# EAGLE schematic Frontboard (EAGLE 9.0.1)
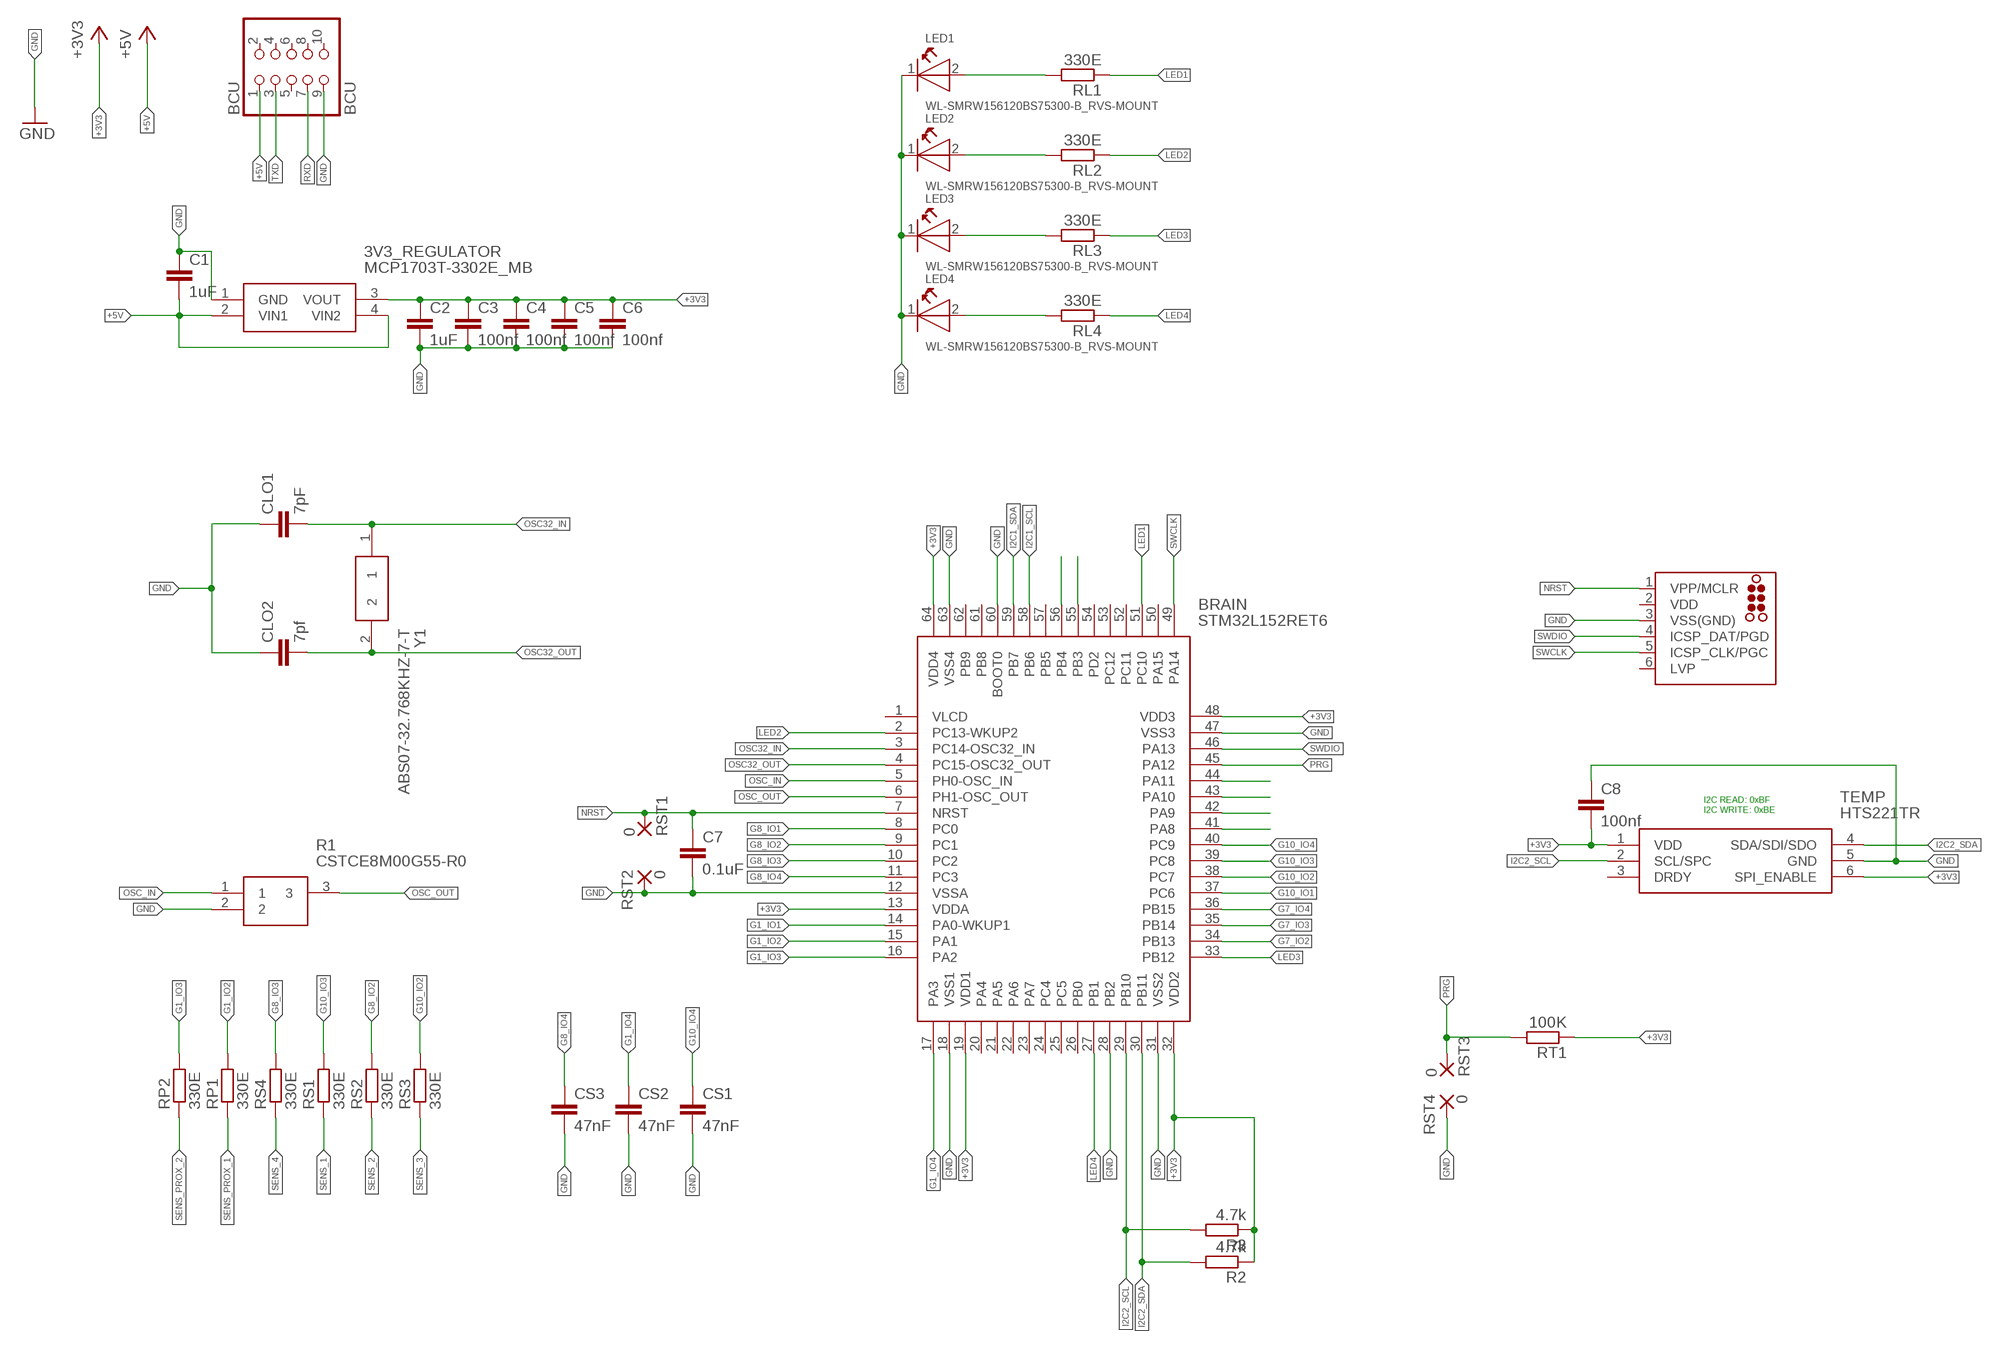
[diagram p0: schematic, sheet 1]

## Parts
3V3_REGULATOR  MCP1703T-3302E_MB  [SOT-89(MB)]
BCU  BCU  PINHD-2X5_2.54-SMD  [2X05SMD]
BRAIN  STM32L152RET6  [QFP50P1200X1200X160-64N]
C1  1uF  C-EUC0603  [C0603]
C2  1uF  C-EUC0603  [C0603]
C3  100nf  C-EUC0603  [C0603]
C4  100nf  C-EUC0603  [C0603]
C5  100nf  C-EUC0603  [C0603]
C6  100nf  C-EUC0603  [C0603]
C7  0.1uF  C-EUC0603  [C0603]
C8  100nf  C-EUC0603  [C0603]
CLO1  7pF  C-EUC0603  [C0603]
CLO2  7pf  C-EUC0603  [C0603]
CS1  47nF  C-EUC0603  [C0603]
CS2  47nF  C-EUC0603  [C0603]
CS3  47nF  C-EUC0603  [C0603]
LED1  WL-SMRW156120BS75300-B_RVS-MOUNT  [WL-SMRW-1206-CYLDR-REVERSE-MOUNT]
LED2  WL-SMRW156120BS75300-B_RVS-MOUNT  [WL-SMRW-1206-CYLDR-REVERSE-MOUNT]
LED3  WL-SMRW156120BS75300-B_RVS-MOUNT  [WL-SMRW-1206-CYLDR-REVERSE-MOUNT]
LED4  WL-SMRW156120BS75300-B_RVS-MOUNT  [WL-SMRW-1206-CYLDR-REVERSE-MOUNT]
R1  CSTCE8M00G55-R0  [CSTCE12M0G55-R0]
R2  4.7k  R-EU_R0603  [R0603]
R3  4.7k  R-EU_R0603  [R0603]
RL1  330E  R-EU_R0603  [R0603]
RL2  330E  R-EU_R0603  [R0603]
RL3  330E  R-EU_R0603  [R0603]
RL4  330E  R-EU_R0603  [R0603]
RP1  330E  R-EU_R0603  [R0603]
RP2  330E  R-EU_R0603  [R0603]
RS1  330E  R-EU_R0603  [R0603]
RS2  330E  R-EU_R0603  [R0603]
RS3  330E  R-EU_R0603  [R0603]
RS4  330E  R-EU_R0603  [R0603]
RST1  0  SMD5  [SMD2,54-5,08]
RST2  0  SMD5  [SMD2,54-5,08]
RST3  0  SMD5  [SMD2,54-5,08]
RST4  0  SMD5  [SMD2,54-5,08]
RT1  100K  R-EU_R0603  [R0603]
SWD  SWD  TC2030-MCP-NL  [TC2030-MCP-NL]
TEMP  HTS221TR  [HLGA-6L]
Y1  ABS07-32.768KHZ-7-T  [ABS-07]

## Nets
+3V3: 3V3_REGULATOR.3(VOUT) BRAIN.13(VDDA) BRAIN.19(VDD1) BRAIN.32(VDD2) BRAIN.48(VDD3) BRAIN.64(VDD4) C2.1 C3.1 C4.1 C5.1 C6.1 C8.2 R2.1 R3.1 RT1.1 TEMP.1(VDD) TEMP.6(SPI_ENABLE)
+5V: 3V3_REGULATOR.2(VIN1) 3V3_REGULATOR.4(VIN2) BCU.1 C1.2
G1_IO1: BRAIN.14(PA0-WKUP1)
G1_IO2: BRAIN.15(PA1) RP1.2
G1_IO3: BRAIN.16(PA2) RP2.2
G1_IO4: BRAIN.17(PA3) CS2.1
G7_IO2: BRAIN.34(PB13)
G7_IO3: BRAIN.35(PB14)
G7_IO4: BRAIN.36(PB15)
G8_IO1: BRAIN.8(PC0)
G8_IO2: BRAIN.9(PC1) RS2.2
G8_IO3: BRAIN.10(PC2) RS4.2
G8_IO4: BRAIN.11(PC3) CS3.1
G10_IO1: BRAIN.37(PC6)
G10_IO2: BRAIN.38(PC7) RS3.2
G10_IO3: BRAIN.39(PC8) RS1.2
G10_IO4: BRAIN.40(PC9) CS1.1
GND: 3V3_REGULATOR.1(GND) BCU.9 BRAIN.12(VSSA) BRAIN.18(VSS1) BRAIN.28(PB2) BRAIN.31(VSS2) BRAIN.47(VSS3) BRAIN.60(BOOT0) BRAIN.63(VSS4) C1.1 C2.2 C3.2 C4.2 C5.2 C6.2 C7.2 C8.1 CLO1.1 CLO2.1 CS1.2 CS2.2 CS3.2 LED1.1(K) LED2.1(K) LED3.1(K) LED4.1(K) R1.2 RST2.1(P) RST4.1(P) SWD.3(VSS(GND)) TEMP.5(GND)
I2C1_SCL: BRAIN.58(PB6)
I2C1_SDA: BRAIN.59(PB7)
I2C2_SCL: BRAIN.29(PB10) R3.2 TEMP.2(SCL/SPC)
I2C2_SDA: BRAIN.30(PB11) R2.2 TEMP.4(SDA/SDI/SDO)
LED1: BRAIN.51(PC10) RL1.1
LED2: BRAIN.2(PC13-WKUP2) RL2.1
LED3: BRAIN.33(PB12) RL3.1
LED4: BRAIN.27(PB1) RL4.1
N$1: BRAIN.55(PB3)
N$2: BRAIN.56(PB4)
N$3: BRAIN.41(PA8)
N$7: BRAIN.42(PA9)
N$8: BRAIN.43(PA10)
N$9: BRAIN.44(PA11)
N$19: LED1.2(A) RL1.2
N$20: LED2.2(A) RL2.2
N$21: LED3.2(A) RL3.2
N$22: LED4.2(A) RL4.2
NRST: BRAIN.7(NRST) C7.1 RST1.1(P) SWD.1(VPP/MCLR)
OSC32_IN: BRAIN.3(PC14-OSC32_IN) CLO1.2 Y1.1
OSC32_OUT: BRAIN.4(PC15-OSC32_OUT) CLO2.2 Y1.2
OSC_IN: BRAIN.5(PH0-OSC_IN) R1.1
OSC_OUT: BRAIN.6(PH1-OSC_OUT) R1.3
PRG: BRAIN.45(PA12) RST3.1(P) RT1.2
RXD: BCU.7
SENS_1: RS1.1
SENS_2: RS2.1
SENS_3: RS3.1
SENS_4: RS4.1
SENS_PROX_1: RP1.1
SENS_PROX_2: RP2.1
SWCLK: BRAIN.49(PA14) SWD.5(ICSP_CLK/PGC)
SWDIO: BRAIN.46(PA13) SWD.4(ICSP_DAT/PGD)
TXD: BCU.3
Unconnected: BCU.2 BCU.4 BCU.5 BCU.6 BCU.8 BCU.10 BRAIN.20(PA4) BRAIN.21(PA5) BRAIN.22(PA6) BRAIN.23(PA7) BRAIN.24(PC4) BRAIN.25(PC5) BRAIN.26(PB0) BRAIN.50(PA15) BRAIN.52(PC11) BRAIN.53(PC12) BRAIN.54(PD2) BRAIN.57(PB5) BRAIN.61(PB8) BRAIN.62(PB9) SWD.6(LVP) TEMP.3(DRDY)

## Notes on the sheet
- I2C READ: 0xBF
  I2C WRITE: 0xBE

## Power pins joined to a net without a drawn wire
VDD: SWD.2(VDD)
VLCD: BRAIN.1(VLCD)

## Library data of the parts
3V3_REGULATOR = MCP1703T-3302E_MB:MCP1703T-3302E_MB: LDO Low Iq 250mA 16V 3.3V 2% SOT89 Microchip MCP1703T-3302E/MB, LDO Voltage Regulator, 250mA, 3.3 V 2%, 2.7 16 Vin, 3-Pin SOT-89 Source: Datasheet <http://ww1.microchip.com/downloads/en/DeviceDoc/22049f.pdf>; ALLIED_NUMBER: 70047986; ALLIED_PRICE/STOCK: https://www.alliedelec.com/microchip-technology-inc-mcp1703t-3302e-mb/70047986/; ARROW_PART_NUMBER: MCP1703T-3302E/MB; ARROW_PRICE/STOCK: https://www.arrow.com/en/products/mcp1703t-3302emb/microchip-technology; DESCRIPTION: LDO Low Iq 250mA 16V 3.3V 2% SOT89 Microchip MCP1703T-3302E/MB, LDO Voltage Regulator, 250mA, 3.3 V 2%, 2.7 16 Vin, 3-Pin SOT-89; HEIGHT: mm; MANUFACTURER_NAME: Microchip; MANUFACTURER_PART_NUMBER: MCP1703T-3302E/MB; RS_PART_NUMBER: 9122916; RS_PRICE/STOCK: http://uk.rs-online.com/web/p/products/9122916
BCU = pinhead:PINHD-2X5: PIN HEADER
BRAIN = STM32L152RET6:STM32L152RET6: STMICROELECTRONICS - STM32L152RET6 - MCU, 32BIT, CORTEX-M3, 32MHZ, LQFP-64 Source: Datasheet <https://componentsearchengine.com/Datasheets/2/STM32L152RET6.pdf>; ARROW_PART_NUMBER: STM32L152RET6; ARROW_PRICE/STOCK: https://www.arrow.com/en/products/stm32l152ret6/stmicroelectronics; DESCRIPTION: STMICROELECTRONICS - STM32L152RET6 - MCU, 32BIT, CORTEX-M3, 32MHZ, LQFP-64; HEIGHT: 1.6mm; MANUFACTURER_NAME: STMicroelectronics; MANUFACTURER_PART_NUMBER: STM32L152RET6
C1-C8 CLO1 CLO2 CS1-CS3 = rcl:C-EU: CAPACITOR, European symbol; SPICEPREFIX: C
LED1-LED4 = Wurth_Elektronik_Optoelectronics_rev15b (1):WL-SMRW: SMD Reverse mount mono-color rectangular Characteristics Small size & thin body for space saving Ideal for narrow space applications Wide viewing angle Low power consumption Industry standard footprint Small package for exceptional brightness To emit light through a small cut-out hole in PCB Compatible with automatic placement machine Applications Front panel indicators LCD backlighting Keypad backlighting Push button backlighting Symbol and switch backlighting General lighting <http://katalog.we-online.de/media/images/eipal/WL-SMRW_pf2.jpg> Details see: http://katalog.we-online.de/en/led/WL-SMRW?m Updated 2015-04-10 2015 (C) Wurth Elektronik
R1 = CSTCE8M00G55-R0:CSTCE8M00G55-R0: SMT ceramic resonator 8.0MHz CSTCE8M00G55-R0, Ceramic Resonator, 8MHz Fundamental 33pF, 3-Pin Cap Chip, 3.2 x 1.3 x 0.7mm Source: Datasheet <http://www.murata.com/en-eu/api/pdfdownloadapi?cate=&partno=CSTCE8M00G55-R0>; ARROW_PART_NUMBER: CSTCE8M00G55-R0; ARROW_PRICE/STOCK: https://www.arrow.com/en/products/cstce8m00g55-r0/murata-manufacturing; DESCRIPTION: SMT ceramic resonator 8.0MHz CSTCE8M00G55-R0, Ceramic Resonator, 8MHz Fundamental 33pF, 3-Pin Cap Chip, 3.2 x 1.3 x 0.7mm; HEIGHT: mm; MANUFACTURER_NAME: Murata Electronics; MANUFACTURER_PART_NUMBER: CSTCE8M00G55-R0; RS_PART_NUMBER: 7214821P; RS_PRICE/STOCK: http://uk.rs-online.com/web/p/products/7214821P
R2 R3 RL1-RL4 RP1 RP2 RS1-RS4 RT1 = rcl:R-EU_: RESISTOR, European symbol; SPICEPREFIX: R
RST1-RST4 = wirepad:SMD5: SMD PAD
SWD = tag-connect:TC2030: TAG-CONNECT ICSP Connector Manufacturer: Tag-Connect <http://www.tag-connect.com> Cable for easy In-Circuit Serial Programming. Designed for Microchip ICD2, suitable for many others. Two variants - one "with legs" (for hands-free fit on PCB) and another "without legs" for quick programming. PAD Description 1 MCLR/Vpp 2 Vdd 3 GND 4 PGD (ISPDAT) 5 PGC (ISPCLK) 6 nc (used for LVP) ©2009 ROFA.cz - modified and updated by Robert Darlington ‹rdarlington@gmail.com›
TEMP = HTS221TR:HTS221TR: Humidity and Temperature Sensor HLGA6 STMicroelectronics HTS221TR Temperature & Humidity Sensor, -40 +120 C, 6-Pin HLGA Source: Datasheet <http://www.st.com/content/ccc/resource/technical/document/datasheet/4d/9a/9c/ad/25/07/42/34/DM00116291.pdf/files/DM00116291.pdf/jcr:content/translations/en.DM00116291.pdf>; ARROW_PART_NUMBER: HTS221TR; ARROW_PRICE/STOCK: https://www.arrow.com/en/products/hts221tr/stmicroelectronics; DESCRIPTION: Humidity and Temperature Sensor HLGA6 STMicroelectronics HTS221TR Temperature & Humidity Sensor, -40 +120 C, 6-Pin HLGA; HEIGHT: mm; MANUFACTURER_NAME: STMicroelectronics; MANUFACTURER_PART_NUMBER: HTS221TR; RS_PART_NUMBER: 1660935; RS_PRICE/STOCK: http://uk.rs-online.com/web/p/products/1660935
Y1 = ABS07-32.768KHZ-7-T:ABS07-32.768KHZ-7-T: ABRACON - ABS07-32.768KHZ-7-T - CRYSTAL, 32.768KHZ, 7PF, SMD Source: Datasheet <https://componentsearchengine.com/Datasheets/2/ABS07-32.768KHZ-7-T.pdf>; ARROW_PART_NUMBER: ABS07-32.768KHZ-7-T; ARROW_PRICE/STOCK: https://www.arrow.com/en/products/abs07-32.768khz-7-t/abracon; DESCRIPTION: ABRACON - ABS07-32.768KHZ-7-T - CRYSTAL, 32.768KHZ, 7PF, SMD; HEIGHT: mm; MANUFACTURER_NAME: ABRACON; MANUFACTURER_PART_NUMBER: ABS07-32.768KHZ-7-T; RS_PART_NUMBER: 1712773P; RS_PRICE/STOCK: http://uk.rs-online.com/web/p/products/1712773P